# EAGLE schematic puddigDCconverterNotUse (EAGLE 7.1.0)
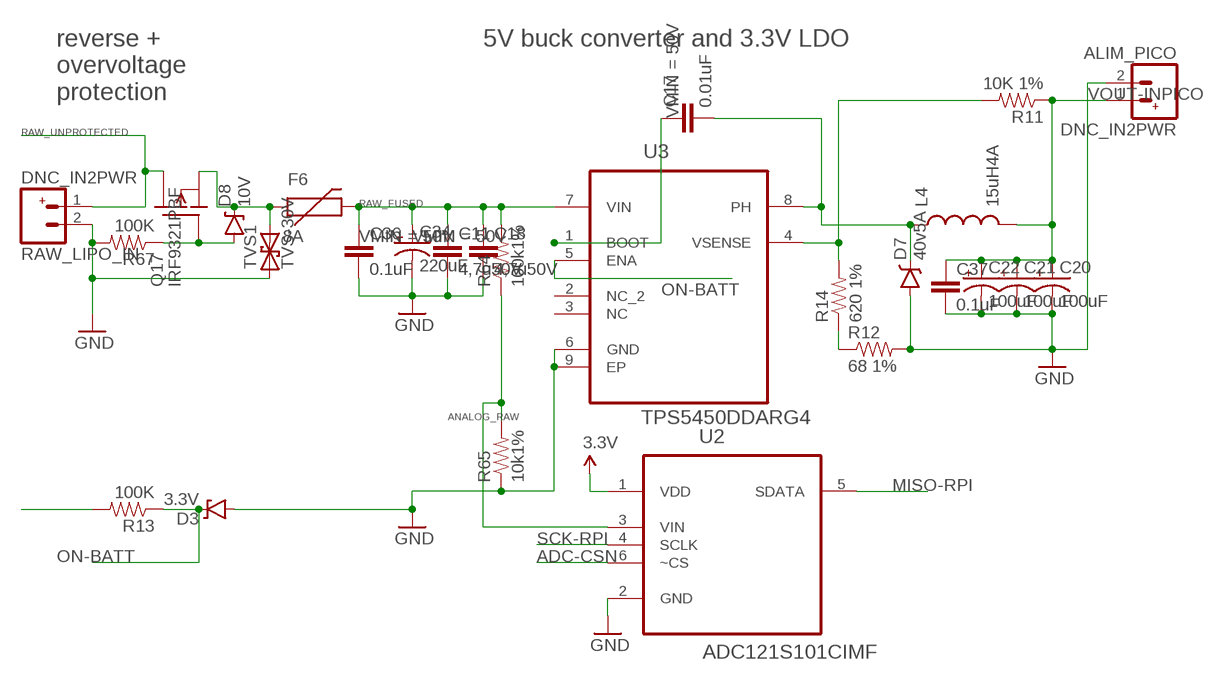
[diagram p0: schematic, sheet 1]

## Parts
ALIM_PICO  DNC_IN2PWR  [DNC_IN2_PWR]
C11  4,7u50V  CAP1206  [1206]
C17  0.01uF  C-EUC0603  [C0603]
C18  4,7u50V  CAP1206  [1206]
C20  100uF  100UF-10V-10%(TANT)  [EIA7343]
C21  100uF  100UF-10V-10%(TANT)  [EIA7343]
C22  100uF  100UF-10V-10%(TANT)  [EIA7343]
C34  220uF  CAP_POLE  [PANASONIC_E]
C36  0.1uF  C-EUC0603  [C0603]
C37  0.1uF  C-EUC0603  [C0603]
D3  3.3V  DIODE-ZENERSOD-123  [SOD-123]
D7  40v5A  DIODE_SCHOTKYSMPA  [DO-221]
D8  10V  DIODE-ZENERSOD-123  [SOD-123]
F6  8A  PTCPTH  [PTC]
L4  15uH4A  INDUCTORPWR  [CDRH125]
Q17  IRF9321PBF  [SO-8]
R11  10K 1%  RESISTOR0603-RES  [0603-RES]
R12  68 1%  RESISTOR0603-RES  [0603-RES]
R13  100K  RESISTOR0603-RES  [0603-RES]
R14  620 1%  RESISTOR0603-RES  [0603-RES]
R64  100k1%  RESISTOR0603-RES  [0603-RES]
R65  10k1%  RESISTOR0603-RES  [0603-RES]
R67  100K  RESISTOR0603-RES  [0603-RES]
RAW_LIPO_IN  DNC_IN2PWR  [DNC_IN2_PWR]
TVS1  TVS-30V  TVS  [SMA-DIODE]
U2  ADC121S101CIMF  [SOT95P284X122-6N]
U3  TPS5450DDARG4  [SOIC127P600X170-9N]

## Nets
3.3V [3.3V]: U2.1(VDD)
ADC-CSN: U2.6(~CS)
ANALOG_RAW: R64.1 R65.2 U2.3(VIN)
GND [GND]: ALIM_PICO.2(-) C11.2 C18.2 C20.C(-) C21.C(-) C22.C(-) C34.- C36.2 C37.2 D3.A D7.A R12.2 R65.1 R67.2 RAW_LIPO_IN.2(-) TVS1.A U2.2(GND) U3.6(GND) U3.9(EP)
MISO-RPI: U2.5(SDATA)
N$12: R11.2 R14.2 U3.4(VSENSE)
N$16: C17.1 U3.1(BOOT)
N$18: R12.1 R14.1
N$28 [5V]: C17.2 D7.C L4.1 U3.8(PH)
ON-BATT: D3.C R13.1 U3.5(ENA)
PROTECT_GATE1: D8.A Q17.4(G) R67.1
RAW_FUSED [5V]: C11.1 C18.1 C34.+ C36.1 F6.P$2 R13.2 R64.2 U3.7(VIN)
RAW_POL_PROTECTED1 [5V]: D8.C F6.P$1MOV Q17.1(S) Q17.2(S) Q17.3(S) TVS1.C
RAW_UNPROTECTED [5V]: Q17.5(D) Q17.6(D) Q17.7(D) Q17.8(D) RAW_LIPO_IN.1(+)
SCK-RPI: U2.4(SCLK)
VOUT-INPICO [5V]: ALIM_PICO.1(+) C20.A(+) C21.A(+) C22.A(+) C37.1 L4.2 R11.1
Unconnected: U3.2(NC_2) U3.3(NC)

## Notes on the sheet
- 5V buck converter and 3.3V LDO
- reverse + 
  overvoltage 
  protection

## Library data of the parts
ALIM_PICO RAW_LIPO_IN = pierre_vv:DNC_IN2; MOUNT: NO
C11 C18 = SparkFun-Capacitors:CAP: Capacitor Standard 0603 ceramic capacitor, and 0.1" leaded capacitor.; OC_FARNELL: 2112859
C17 C36 = rcl:C-EU: CAPACITOR, European symbol; VMIN: 50V
C20-C22 = SparkFun-Capacitors:100UF-10V-10%(TANT): CAP-07890; OC_FARNELL: 2535240; PROD_ID: CAP-07890
C34 = SparkFun:CAP_POL: Capacitor Polarized These are standard SMD and PTH capacitors. Normally 10uF, 47uF, and 100uF in electrolytic and tantalum varieties. Always verify the external diameter of the through hole cap, it varies with capacity, voltage, and manufacturer. The EIA devices should be standard.; OC_FARNELL: 1800687; VMIN: 50V
C37 = rcl:C-EU: CAPACITOR, European symbol
D3 = SparkFun-DiscreteSemi:DIODE-ZENER: Zener Diode Production Part - 8199 3.4V Zener Voltage; OC_FARNELL: 2454044
D7 = pierre_vv:DIODE_SCHOTKY; OC_FARNELL: 1861427
D8 = SparkFun-DiscreteSemi:DIODE-ZENER: Zener Diode Production Part - 8199 3.4V Zener Voltage; OC_FARNELL: 1431256
F6 = SparkFun:PTC: Resettable Fuse PTC Resettable Fuse. Spark Fun Electronics SKU : COM-08357; MOUNT: NO; OC_FARNELL: 1861144
L4 = SparkFun:INDUCTOR: Inductors Basic Inductor/Choke - 0603 and 1206. Footprints are not proven and vary greatly between part numbers.; OC_FARNELL: 2113015
Q17 = pierre_vv:IRF9321PBF; OC_FARNELL: 1831075
R11-R14 R64 R65 R67 = SparkFun-Passives:RESISTOR: Resistor Basic schematic elements and footprints for 0603, 1206, and PTH resistors.
TVS1 = SparkFun:TVS; OC_FARNELL: 9802819RL
U2 = pierre_vv:ADC121S101CIMF: A/D Converters; MPN: ADC121S101CIMF; OC_FARNELL: 1007992; OC_NEWARK: 41K1589; PACKAGE: SOT-6; SUPPLIER: National Semiconductor
U3 = pierre_vv:TPS5450DDARG4: STEP-DOWN SWIFT CONVERTER; MPN: TPS5450DDARG4; OC_FARNELL: 1703401; OC_NEWARK: 59M7214; PACKAGE: SOIC-8; SUPPLIER: Texas Instruments

## Net classes
0 default: width 0.254 mm
1 GND: width 0.406 mm
2 3.3V: width 0.406 mm
3 5V: width 0.305 mm